# Altium schematic sheet connect.SchDoc
size A4
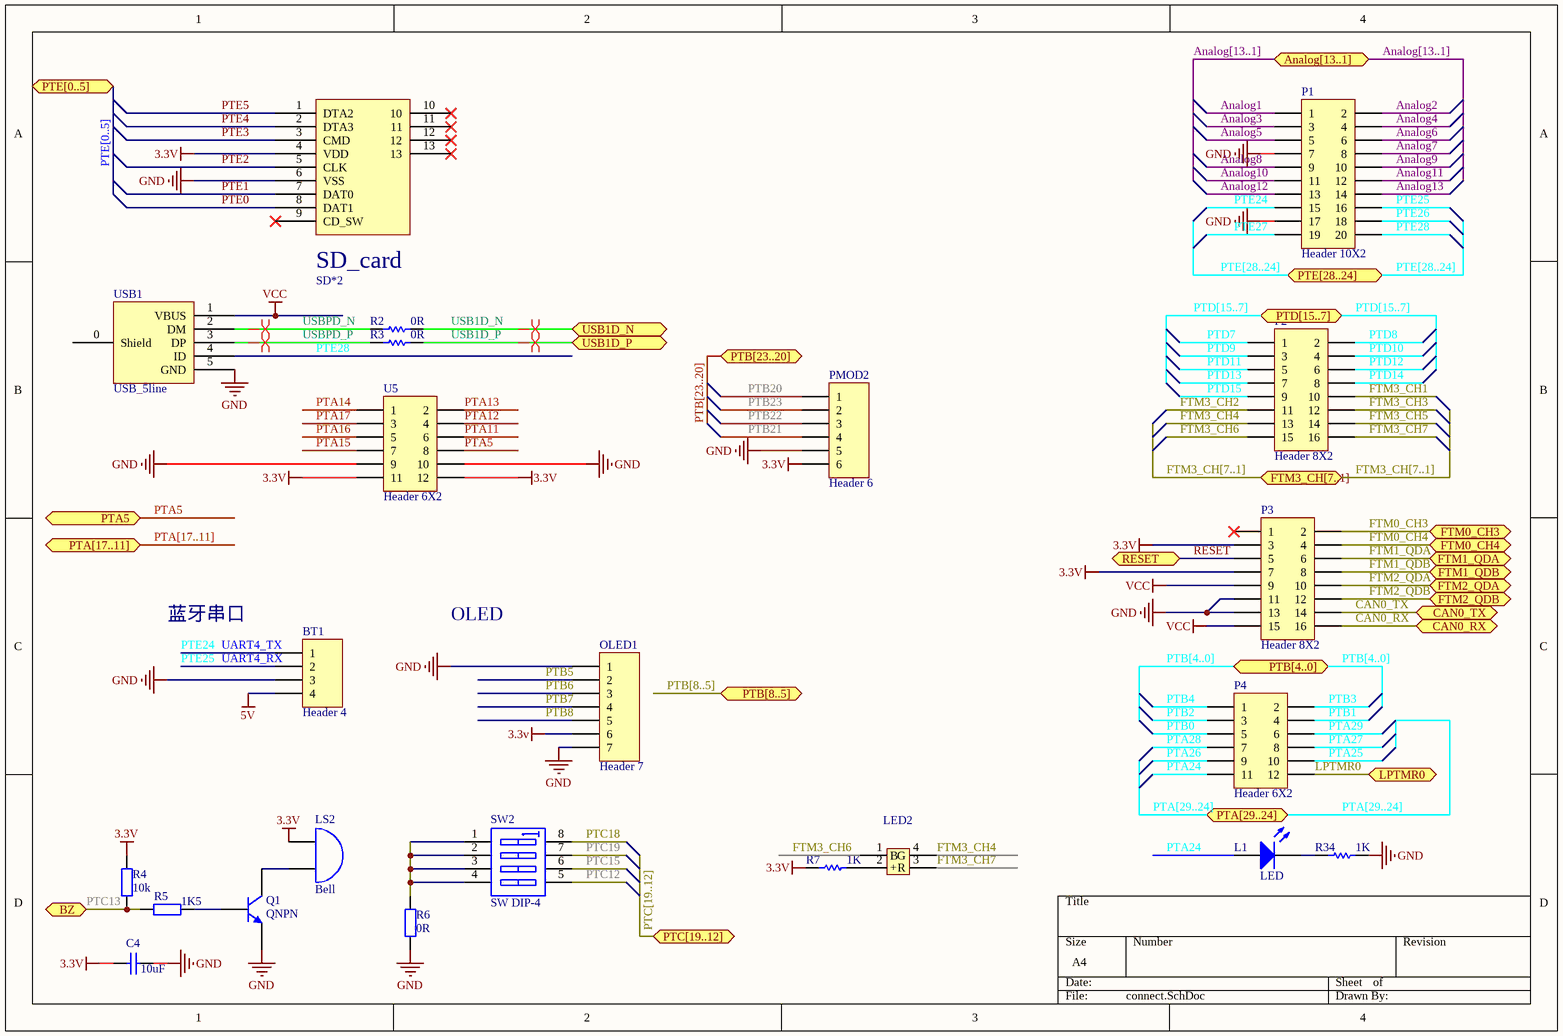
[diagram p0: connect.SchDoc]

## Parts
BT1  Header 4  [HDR1X4]
C4  value 10uF  [C2012]  (hidden comment: Cap)
L1  LED  [1608[0603]]
LED2  RGB_LED1206  [RGB]  (value not drawn)
LS2  Bell  [BZ]
OLED1  Header 7  [HDR1X7]
P1  Header 10X2  [HDR2X10]
P2  Header 8X2  [HDR2X8]
P3  Header 8X2  [HDR2X8]
P4  Header 6X2  [HDR2X6]
PMOD2  Header 6  [HDR1X6]
Q1  QNPN  [SOT23_N]
R2  value 0R  [1608[0603]]  (hidden comment: Res)
R3  value 0R  [1608[0603]]  (hidden comment: Res)
R4  10k  [1608[0603]]
R5  value 1K5  [1608[0603]]  (hidden comment: Res2)
R6  value 0R  [1608[0603]]  (hidden comment: Res2)
R7  value 1K  [1608[0603]]  (hidden comment: Res)
R34  value 1K  [1608[0603]]  (hidden comment: Res)
SD*2  TF_card  [TF卡座(短体)]  (value not drawn)
SW2  SW DIP-4  [SOIC-8]
U5  Header 6X2  [HDR2X6]
USB1  USB_5line  [USB-MICRO-5P-2F]

## Ports
Analog[13..1], BZ, CAN0_RX, CAN0_TX, FTM0_CH3, FTM0_CH4, FTM1_QDA, FTM1_QDB, FTM2_QDA, FTM2_QDB, FTM3_CH[7..1], LPTMR0, PTA5, PTA[17..11], PTA[29..24], PTB[4..0], PTB[8..5], PTB[23..20], PTC[19..12], PTD[15..7], PTE[0..5], PTE[28..24], RESET, USB1D_N, USB1D_P

## Nets
3.3V: C4.2 LS2.1(A) OLED1.6 P3.3 P3.7 PMOD2.6 R4.1 R7.2 SD*2.4(VDD) U5.11 U5.12
5V: BT1.4
GND: BT1.3 C4.1 OLED1.1 OLED1.7 P1.7 P1.17 P3.11 P3.13 PMOD2.5 Q1.3(E) R6.1 R34.1 SD*2.6(VSS) U5.9 U5.10 USB1.5(GND)
VCC: P3.9 P3.15 USB1.1(VBUS)
Analog1: P1.1
Analog2: P1.2
Analog3: P1.3
Analog4: P1.4
Analog5: P1.5
Analog6: P1.6
Analog7: P1.8
Analog8: P1.9
Analog9: P1.10
Analog10: P1.11
Analog11: P1.12
Analog12: P1.13
Analog13: P1.14
CAN0_RX: P3.16 ; port CAN0_RX
CAN0_TX: P3.14 ; port CAN0_TX
FTM0_CH3: P3.2 ; port FTM0_CH3
FTM0_CH4: P3.4 ; port FTM0_CH4
FTM1_QDA: P3.6 ; port FTM1_QDA
FTM1_QDB: P3.8 ; port FTM1_QDB
FTM2_QDA: P3.10 ; port FTM2_QDA
FTM2_QDB: P3.12 ; port FTM2_QDB
FTM3_CH1: P2.10
FTM3_CH2: P2.11
FTM3_CH3: P2.12
FTM3_CH4: LED2.4(G) P2.13
FTM3_CH5: P2.14
FTM3_CH6: LED2.1(B) P2.15
FTM3_CH7: LED2.3(R) P2.16
LPTMR0: P4.12 ; port LPTMR0
PTA5: U5.8 ; port PTA5
PTA11: U5.6
PTA12: U5.4
PTA13: U5.2
PTA14: U5.1
PTA15: U5.7
PTA16: U5.5
PTA17: U5.3
PTA24: L1.1(A) P4.11
PTA25: P4.10
PTA26: P4.9
PTA27: P4.8
PTA28: P4.7
PTA29: P4.6
PTB0: P4.5
PTB1: P4.4
PTB2: P4.3
PTB3: P4.2
PTB4: P4.1
PTB5: OLED1.2
PTB6: OLED1.3
PTB7: OLED1.4
PTB8: OLED1.5
PTB20: PMOD2.1
PTB21: PMOD2.4
PTB22: PMOD2.3
PTB23: PMOD2.2
PTC12: SW2.5(B4)
PTC13: R4.2 R5.2 ; port BZ
PTC15: SW2.6(B3)
PTC18: SW2.8(B1)
PTC19: SW2.7(B2)
PTD7: P2.1
PTD8: P2.2
PTD9: P2.3
PTD10: P2.4
PTD11: P2.5
PTD12: P2.6
PTD13: P2.7
PTD14: P2.8
PTD15: P2.9
PTE0: SD*2.8(DAT1)
PTE1: SD*2.7(DAT0)
PTE2: SD*2.5(CLK)
PTE3: SD*2.3(CMD)
PTE4: SD*2.2(DTA3)
PTE5: SD*2.1(DTA2)
PTE24: BT1.1 P1.15  [also labelled UART4_TX]
PTE25: BT1.2 P1.16  [also labelled UART4_RX]
PTE26: P1.18
PTE27: P1.19
PTE28: P1.20 USB1.4(ID)
RESET: P3.5 ; port RESET
USB1D_N: R2.1 ; port USB1D_N
USB1D_P: R3.1 ; port USB1D_P
USBPD_N: R2.2 USB1.2(DM)
USBPD_P: R3.2 USB1.3(DP)
NetL1_2: L1.2(K) R34.2
NetLED2_2: LED2.2(+) R7.1
NetLS2_2: LS2.2(B) Q1.1(C)
NetQ1_2: Q1.2(B) R5.1
NetR6_2: R6.2 SW2.1(A1) SW2.2(A2) SW2.3(A3) SW2.4(A4)

Not connected (* = marked no-connect by the designer): P3 1*; SD*2 9(CD_SW)* 10* 11* 12* 13*; USB1 0(Shield)

## Buses and harness runs
bus Analog[13..1] = port Analog[13..1]
bus FTM3_CH[7..1] = port FTM3_CH[7..1]
bus PTA[17..11] = port PTA[17..11]
bus PTA[29..24] = port PTA[29..24]
bus PTB[4..0] = port PTB[4..0]
bus PTB[8..5] = port PTB[8..5]
bus PTB[23..20] = port PTB[23..20]
bus PTC[19..12] = port PTC[19..12]
bus PTD[15..7] = port PTD[15..7]
bus PTE[0..5] = port PTE[0..5]
bus PTE[28..24] = port PTE[28..24]

## Layout directives
differential pair: USB1D_N, USB1D_P, USBPD_N, USBPD_P

## Notes on the sheet
- 蓝牙串口
- OLED
- (in symbol TF_card) SD_card

## Library data of the parts
BT1 = Header 4: Header, 4-Pin; LatestRevisionDate: 17-Jul-2002; LatestRevisionNote: Re-released for DXP Platform.; Publisher: Altium Limited
C4 = Cap: Capacitor; Published: 8-Jun-2000; LatestRevisionDate: 17-Jul-2002; LatestRevisionNote: Re-released for DXP Platform.; PackageReference: RAD-0.3; Publisher: Altium Limited; PackageDescription: Radial Cap, Thru-Hole; 2 Leads; 0.3 in Pin Spacing
LS2 = Bell: Electrical Bell; Published: 24-Mar-1999; LatestRevisionDate: 17-Jul-2002; LatestRevisionNote: Re-released for DXP Platform.; PackageReference: PIN2; Publisher: Altium Limited
OLED1 = Header 7: Header, 7-Pin; LatestRevisionDate: 17-Jul-2002; LatestRevisionNote: Re-released for DXP Platform.; Publisher: Altium Limited
P1 = Header 10X2: Header, 10-Pin, Dual row; LatestRevisionDate: 17-Jul-2002; LatestRevisionNote: Re-released for DXP Platform.; Publisher: Altium Limited
P2 P3 = Header 8X2: Header, 8-Pin, Dual row; LatestRevisionDate: 17-Jul-2002; LatestRevisionNote: Re-released for DXP Platform.; Publisher: Altium Limited
P4 U5 = Header 6X2: Header, 6-Pin, Dual row; LatestRevisionDate: 17-Jul-2002; LatestRevisionNote: Re-released for DXP Platform.; Publisher: Altium Limited
PMOD2 = Header 6: Header, 6-Pin; LatestRevisionDate: 17-Jul-2002; LatestRevisionNote: Re-released for DXP Platform.; Publisher: Altium Limited
Q1 = QNPN: NPN Bipolar Transistor; pin to pad: 2>3 3>2; Published: 8-Jun-2000; LatestRevisionDate: 29-May-2009; LatestRevisionNote: IPC-7351 Footprint Added.; PackageVersion: Aug-1999; PackageReference: SOT-23B; Publisher: Altium Limited; PackageDescription: 3-Pin SOT-23 Package 0.95 mm Pitch, 2.4 mm Lead Span
R2 R3 R7 R34 = Res: 贴片电阻; Published: 8-Jun-2000; LatestRevisionDate: 17-Jul-2002; LatestRevisionNote: Re-released for DXP Platform.; PackageReference: AXIAL-0.3; Publisher: Altium Limited
R4 = Res: Resistor of led
R5 R6 = Res2: Resistor; Published: 8-Jun-2000; LatestRevisionDate: 17-Jul-2002; LatestRevisionNote: Re-released for DXP Platform.; PackageReference: AXIAL-0.4; Publisher: Altium Limited; PackageDescription: Axial Device, Thru-Hole; 2 Leads; 0.4 in Pin Spacing
SW2 = SW DIP-4: DIP Switch, 4 Position, SPST; Published: 24-Mar-1999; LatestRevisionDate: 29-May-2009; LatestRevisionNote: IPC-7351 Footprint Added.; PackageVersion: Dec-2002; PackageReference: SO8; Publisher: Altium Limited; PackageDescription: 8-Pin Small Outline Integrated Circuit 1.27 mm Pitch; Code_JEDEC: MS-012-AA; Code_IPC: SOIC127P600-8